# Altium schematic sheet FPGA_FMC.SchDoc
size A3
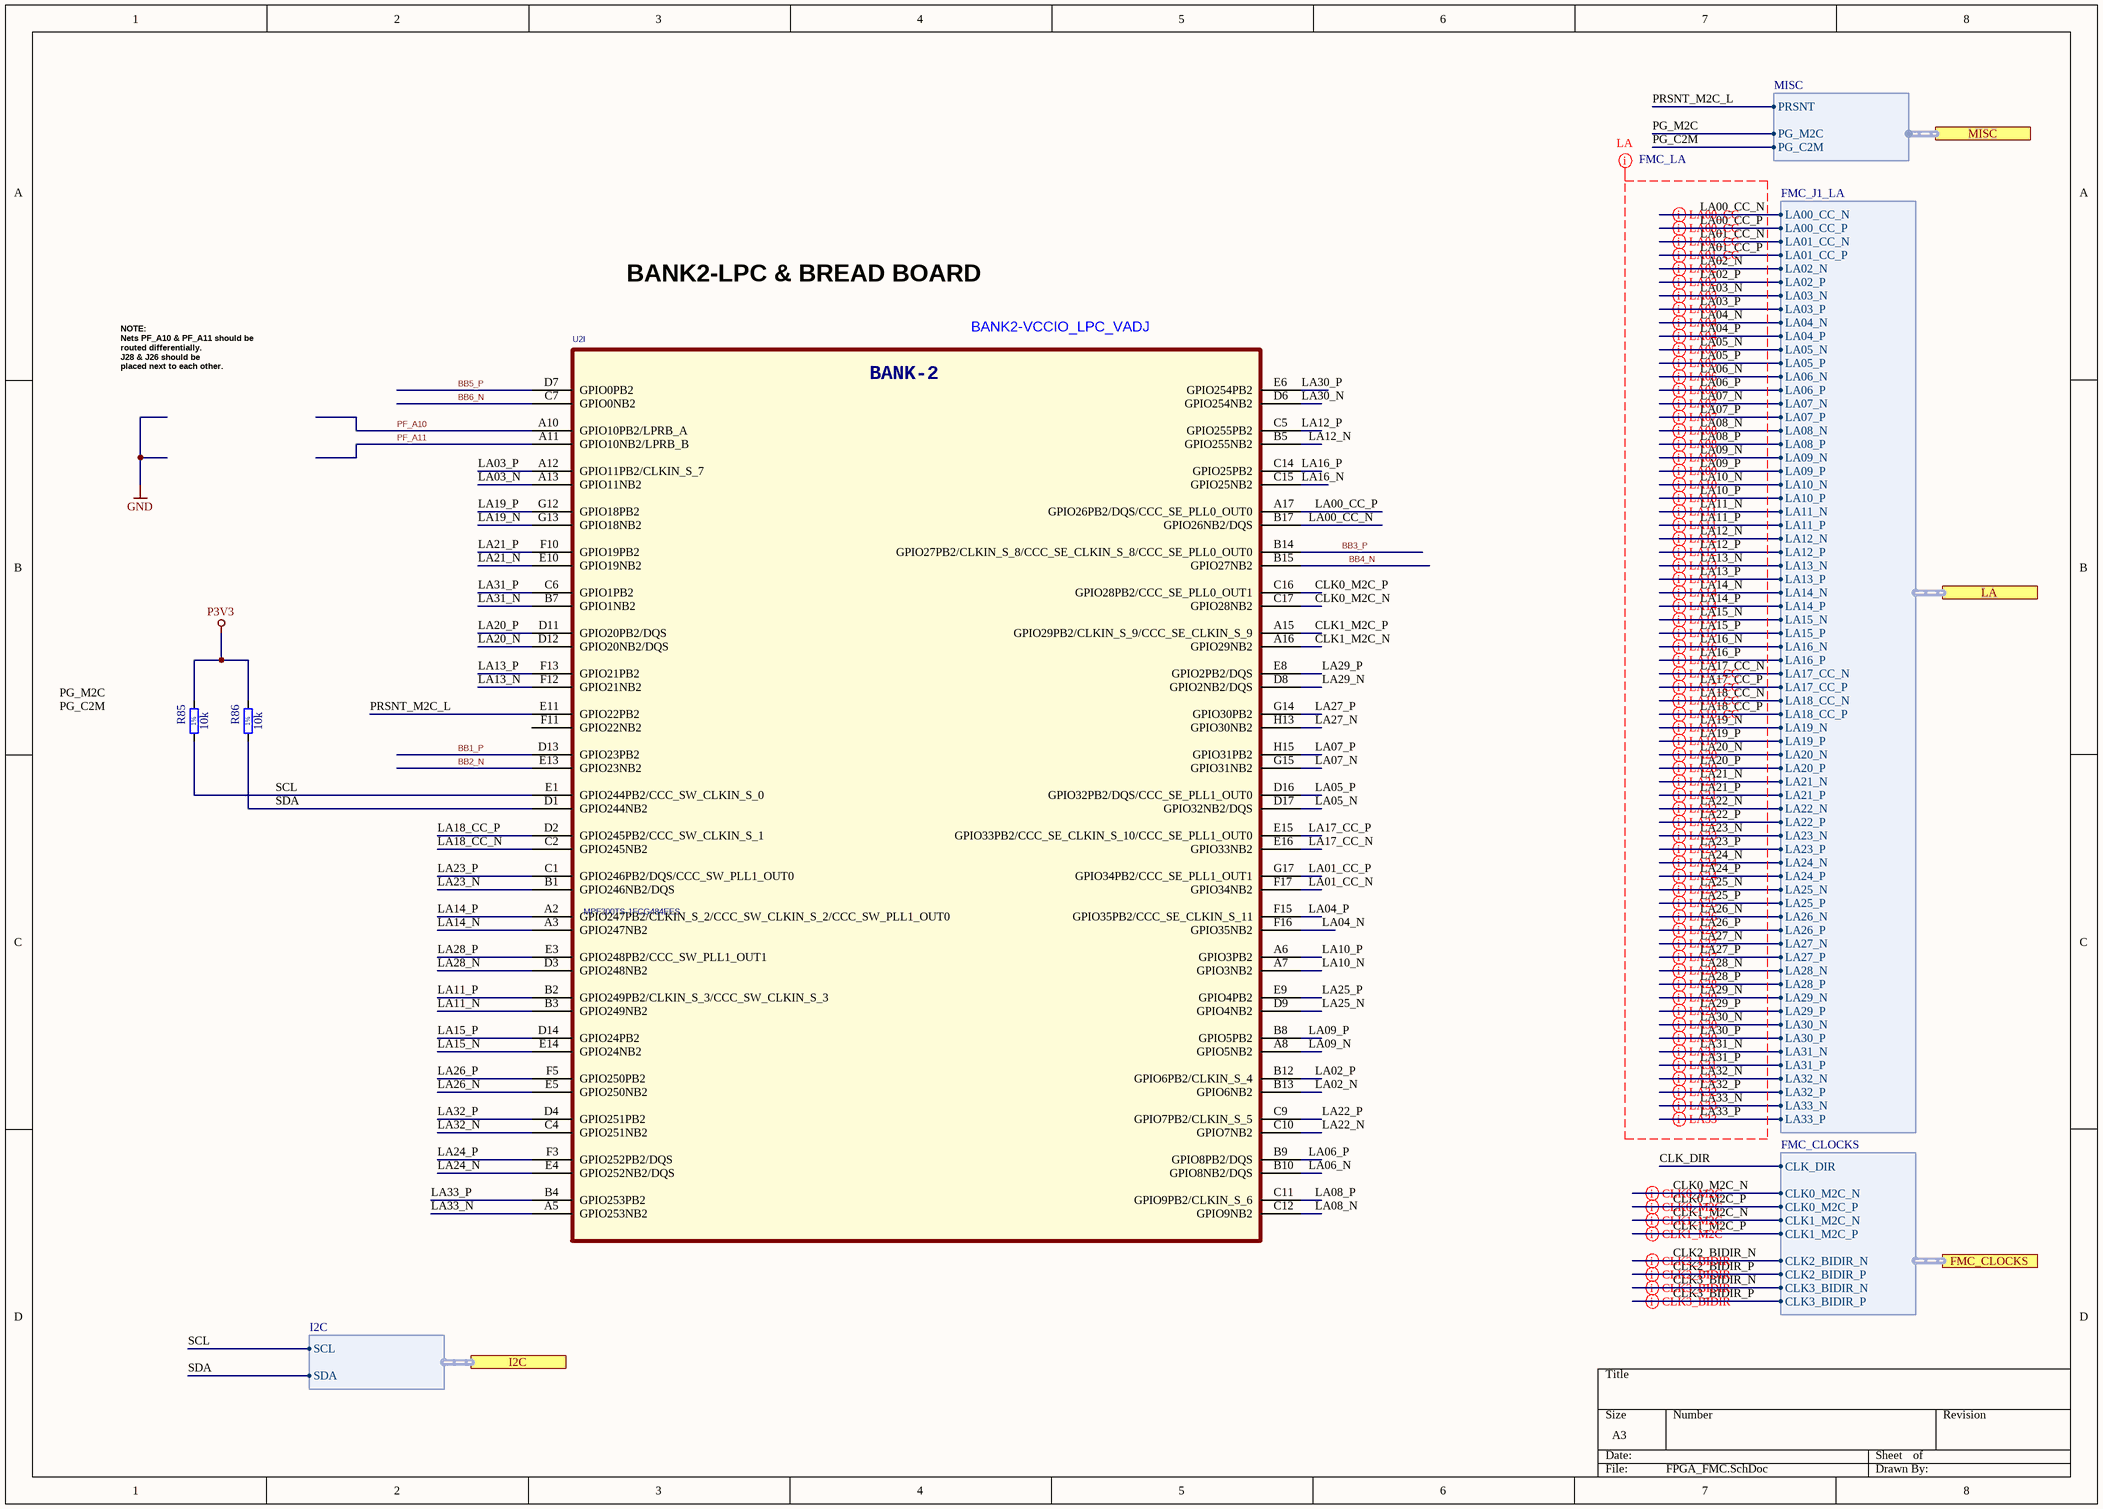
[diagram p0: FPGA_FMC.SchDoc]

## Parts
R85  10k  [RESC1005X40N]
R86  10k  [RESC1005X40N]
U2  MPF300TS-1FCG484EES  [BGA484C100P22X22_2300X2300X320]  (part I of 11)

## Ports
FMC_CLOCKS (harness FMC_CLOCKS), I2C (harness I2C), LA (harness FMC_J1_LA), MISC (harness MISC)

## Harnesses
FMC_J1_LA: LA05_N, LA05_P, LA06_N, LA06_P, LA09_N, LA09_P, LA10_N, LA10_P, LA13_N, LA13_P, LA14_N, LA14_P, LA23_N, LA23_P, LA26_N, LA26_P, LA27_N, LA27_P, LA02_N, LA02_P, LA03_N, LA03_P, LA04_N, LA04_P, LA07_N, LA07_P, LA08_N, LA08_P, LA11_N, LA11_P, LA12_N, LA12_P, LA15_N, LA15_P, LA16_N, LA16_P, LA19_N, LA19_P, LA20_N, LA20_P, LA21_N, LA21_P, LA22_N, LA22_P, LA24_N, LA24_P, LA25_N, LA25_P, LA28_N, LA28_P, LA29_N, LA29_P, LA30_N, LA30_P, LA31_N, LA31_P, LA32_N, LA32_P, LA33_N, LA33_P, LA00_CC_N, LA00_CC_P, LA01_CC_N, LA01_CC_P, LA17_CC_N, LA17_CC_P, LA18_CC_N, LA18_CC_P
FMC_CLOCKS: CLK2_BIDIR_N, CLK2_BIDIR_P, CLK3_BIDIR_N, CLK3_BIDIR_P, CLK0_M2C_N, CLK0_M2C_P, CLK1_M2C_N, CLK1_M2C_P, CLK_DIR
MISC: PRSNT, PG_M2C, PG_C2M
I2C: SCL, SDA

## Nets
P3V3: R85.2 R86.2
BB1_P: U2.D13(GPIO23PB2)
BB2_N: U2.E13(GPIO23NB2)
BB3_P: U2.B14(GPIO27PB2/CLKIN_S_8/CCC_SE_CLKIN_S_8/CCC_SE_PLL0_OUT0)
BB4_N: U2.B15(GPIO27NB2)
BB5_P: U2.D7(GPIO0PB2)
BB6_N: U2.C7(GPIO0NB2)
CLK0_M2C_N: U2.C17(GPIO28NB2) ; port FMC_CLOCKS.CLK0_M2C_N
CLK0_M2C_P: U2.C16(GPIO28PB2/CCC_SE_PLL0_OUT1) ; port FMC_CLOCKS.CLK0_M2C_P
CLK1_M2C_N: U2.A16(GPIO29NB2) ; port FMC_CLOCKS.CLK1_M2C_N
CLK1_M2C_P: U2.A15(GPIO29PB2/CLKIN_S_9/CCC_SE_CLKIN_S_9) ; port FMC_CLOCKS.CLK1_M2C_P
CLK2_BIDIR_N: port FMC_CLOCKS.CLK2_BIDIR_N
CLK2_BIDIR_P: port FMC_CLOCKS.CLK2_BIDIR_P
CLK3_BIDIR_N: port FMC_CLOCKS.CLK3_BIDIR_N
CLK3_BIDIR_P: port FMC_CLOCKS.CLK3_BIDIR_P
CLK_DIR: port FMC_CLOCKS.CLK_DIR
LA00_CC_N: U2.B17(GPIO26NB2/DQS) ; port LA.LA00_CC_N
LA00_CC_P: U2.A17(GPIO26PB2/DQS/CCC_SE_PLL0_OUT0) ; port LA.LA00_CC_P
LA01_CC_N: U2.F17(GPIO34NB2) ; port LA.LA01_CC_N
LA01_CC_P: U2.G17(GPIO34PB2/CCC_SE_PLL1_OUT1) ; port LA.LA01_CC_P
LA02_N: U2.B13(GPIO6NB2) ; port LA.LA02_N
LA02_P: U2.B12(GPIO6PB2/CLKIN_S_4) ; port LA.LA02_P
LA03_N: U2.A13(GPIO11NB2) ; port LA.LA03_N
LA03_P: U2.A12(GPIO11PB2/CLKIN_S_7) ; port LA.LA03_P
LA04_N: U2.F16(GPIO35NB2) ; port LA.LA04_N
LA04_P: U2.F15(GPIO35PB2/CCC_SE_CLKIN_S_11) ; port LA.LA04_P
LA05_N: U2.D17(GPIO32NB2/DQS) ; port LA.LA05_N
LA05_P: U2.D16(GPIO32PB2/DQS/CCC_SE_PLL1_OUT0) ; port LA.LA05_P
LA06_N: U2.B10(GPIO8NB2/DQS) ; port LA.LA06_N
LA06_P: U2.B9(GPIO8PB2/DQS) ; port LA.LA06_P
LA07_N: U2.G15(GPIO31NB2) ; port LA.LA07_N
LA07_P: U2.H15(GPIO31PB2) ; port LA.LA07_P
LA08_N: U2.C12(GPIO9NB2) ; port LA.LA08_N
LA08_P: U2.C11(GPIO9PB2/CLKIN_S_6) ; port LA.LA08_P
LA09_N: U2.A8(GPIO5NB2) ; port LA.LA09_N
LA09_P: U2.B8(GPIO5PB2) ; port LA.LA09_P
LA10_N: U2.A7(GPIO3NB2) ; port LA.LA10_N
LA10_P: U2.A6(GPIO3PB2) ; port LA.LA10_P
LA11_N: U2.B3(GPIO249NB2) ; port LA.LA11_N
LA11_P: U2.B2(GPIO249PB2/CLKIN_S_3/CCC_SW_CLKIN_S_3) ; port LA.LA11_P
LA12_N: U2.B5(GPIO255NB2) ; port LA.LA12_N
LA12_P: U2.C5(GPIO255PB2) ; port LA.LA12_P
LA13_N: U2.F12(GPIO21NB2) ; port LA.LA13_N
LA13_P: U2.F13(GPIO21PB2) ; port LA.LA13_P
LA14_N: U2.A3(GPIO247NB2) ; port LA.LA14_N
LA14_P: U2.A2(GPIO247PB2/CLKIN_S_2/CCC_SW_CLKIN_S_2/CCC_SW_PLL1_OUT0) ; port LA.LA14_P
LA15_N: U2.E14(GPIO24NB2) ; port LA.LA15_N
LA15_P: U2.D14(GPIO24PB2) ; port LA.LA15_P
LA16_N: U2.C15(GPIO25NB2) ; port LA.LA16_N
LA16_P: U2.C14(GPIO25PB2) ; port LA.LA16_P
LA17_CC_N: U2.E16(GPIO33NB2) ; port LA.LA17_CC_N
LA17_CC_P: U2.E15(GPIO33PB2/CCC_SE_CLKIN_S_10/CCC_SE_PLL1_OUT0) ; port LA.LA17_CC_P
LA18_CC_N: U2.C2(GPIO245NB2) ; port LA.LA18_CC_N
LA18_CC_P: U2.D2(GPIO245PB2/CCC_SW_CLKIN_S_1) ; port LA.LA18_CC_P
LA19_N: U2.G13(GPIO18NB2) ; port LA.LA19_N
LA19_P: U2.G12(GPIO18PB2) ; port LA.LA19_P
LA20_N: U2.D12(GPIO20NB2/DQS) ; port LA.LA20_N
LA20_P: U2.D11(GPIO20PB2/DQS) ; port LA.LA20_P
LA21_N: U2.E10(GPIO19NB2) ; port LA.LA21_N
LA21_P: U2.F10(GPIO19PB2) ; port LA.LA21_P
LA22_N: U2.C10(GPIO7NB2) ; port LA.LA22_N
LA22_P: U2.C9(GPIO7PB2/CLKIN_S_5) ; port LA.LA22_P
LA23_N: U2.B1(GPIO246NB2/DQS) ; port LA.LA23_N
LA23_P: U2.C1(GPIO246PB2/DQS/CCC_SW_PLL1_OUT0) ; port LA.LA23_P
LA24_N: U2.E4(GPIO252NB2/DQS) ; port LA.LA24_N
LA24_P: U2.F3(GPIO252PB2/DQS) ; port LA.LA24_P
LA25_N: U2.D9(GPIO4NB2) ; port LA.LA25_N
LA25_P: U2.E9(GPIO4PB2) ; port LA.LA25_P
LA26_N: U2.E5(GPIO250NB2) ; port LA.LA26_N
LA26_P: U2.F5(GPIO250PB2) ; port LA.LA26_P
LA27_N: U2.H13(GPIO30NB2) ; port LA.LA27_N
LA27_P: U2.G14(GPIO30PB2) ; port LA.LA27_P
LA28_N: U2.D3(GPIO248NB2) ; port LA.LA28_N
LA28_P: U2.E3(GPIO248PB2/CCC_SW_PLL1_OUT1) ; port LA.LA28_P
LA29_N: U2.D8(GPIO2NB2/DQS) ; port LA.LA29_N
LA29_P: U2.E8(GPIO2PB2/DQS) ; port LA.LA29_P
LA30_N: U2.D6(GPIO254NB2) ; port LA.LA30_N
LA30_P: U2.E6(GPIO254PB2) ; port LA.LA30_P
LA31_N: U2.B7(GPIO1NB2) ; port LA.LA31_N
LA31_P: U2.C6(GPIO1PB2) ; port LA.LA31_P
LA32_N: U2.C4(GPIO251NB2) ; port LA.LA32_N
LA32_P: U2.D4(GPIO251PB2) ; port LA.LA32_P
LA33_N: U2.A5(GPIO253NB2) ; port LA.LA33_N
LA33_P: U2.B4(GPIO253PB2) ; port LA.LA33_P
PF_A10: U2.A10(GPIO10PB2/LPRB_A)
PF_A11: U2.A11(GPIO10NB2/LPRB_B)
PG_C2M: port MISC.PG_C2M
PG_M2C: port MISC.PG_M2C
PRSNT_M2C_L: U2.E11(GPIO22PB2) ; port MISC.PRSNT
SCL: R85.1 U2.E1(GPIO244PB2/CCC_SW_CLKIN_S_0) ; port I2C.SCL
SDA: R86.1 U2.D1(GPIO244NB2) ; port I2C.SDA

Not connected (* = marked no-connect by the designer): U2 F11(GPIO22NB2)

## Layout directives
differential pair: CLK0_M2C_N, CLK0_M2C_P, CLK1_M2C_N, CLK1_M2C_P, CLK2_BIDIR_N, CLK2_BIDIR_P, CLK3_BIDIR_N, CLK3_BIDIR_P, LA00_CC_N, LA00_CC_P, LA01_CC_N, LA01_CC_P, LA02_N, LA02_P, LA03_N, LA03_P, LA04_N, LA04_P, LA05_N, LA05_P, LA06_N, LA06_P, LA07_N, LA07_P, LA08_N, LA08_P, LA09_N, LA09_P, LA10_N, LA10_P, LA11_N, LA11_P, LA12_N, LA12_P, LA13_N, LA13_P, LA14_N, LA14_P, LA15_N, LA15_P, LA16_N, LA16_P, LA17_CC_N, LA17_CC_P, LA18_CC_N, LA18_CC_P, LA19_N, LA19_P, LA20_N, LA20_P, LA21_N, LA21_P, LA22_N, LA22_P, LA23_N, LA23_P, LA24_N, LA24_P, LA25_N, LA25_P, LA26_N, LA26_P, LA27_N, LA27_P, LA28_N, LA28_P, LA29_N, LA29_P, LA30_N, LA30_P, LA31_N, LA31_P, LA32_N, LA32_P, LA33_N, LA33_P
net class FMC_LA: LA00_CC_N, LA00_CC_P, LA01_CC_N, LA01_CC_P, LA02_N, LA02_P, LA03_N, LA03_P, LA04_N, LA04_P, LA05_N, LA05_P, LA06_N, LA06_P, LA07_N, LA07_P, LA08_N, LA08_P, LA09_N, LA09_P, LA10_N, LA10_P, LA11_N, LA11_P, LA12_N, LA12_P, LA13_N, LA13_P, LA14_N, LA14_P, LA15_N, LA15_P, LA16_N, LA16_P, LA17_CC_N, LA17_CC_P, LA18_CC_N, LA18_CC_P, LA19_N, LA19_P, LA20_N, LA20_P, LA21_N, LA21_P, LA22_N, LA22_P, LA23_N, LA23_P, LA24_N, LA24_P, LA25_N, LA25_P, LA26_N, LA26_P, LA27_N, LA27_P, LA28_N, LA28_P, LA29_N, LA29_P, LA30_N, LA30_P, LA31_N, LA31_P, LA32_N, LA32_P, LA33_N, LA33_P

## Notes on the sheet
- BANK2-LPC & BREAD BOARD
- NOTE:
  Nets PF_A10 & PF_A11 should be
  routed differentially.
  J28 & J26 should be
  placed next to each other.
- BANK2-VCCIO_LPC_VADJ
- Labels drawn without touching a wire or pin: PG_C2M, PG_M2C
- (in symbol FPGA_MPF300T-FCG484, part I) BANK-2
- (in symbol R0402_10K_1%_0.0625W_100PPM) 1%

## Library data of the parts
R85 R86 = R0402_10K_1%_0.0625W_100PPM: Resistor - 1%; Manufacturer: GENERIC; Part Description: General Purpose Thick Film Chip Resistor; Manufacturer1 Part Number: 232270671003L; TC: ±100ppm/°C; PressFit: No; Manufacturer Part Number: R0402_10K_1%_0.0625W_100PPM; Part Number: R0402_10K_1%_0.0625W_100PPM; Tolerance: ±1%; Value: 10k; Component Kind: Standard; Component Type: Standard; Pin Count: 2; Status: Not Recommended; Power: 0.0625W; Case: 0402; Mounted: Yes; Sense: No; Socket: No; SMD: Yes; Manufacturer1 Example: YAGEO PHYCOMP; Manufacturer1 ComponentHeight: 0.4mm; HelpURL: \\cern.ch\dfs\Applications\Altium\Datasheets\R0402_Phycomp_RC0402.pdf; Author: CERN DEM JLC; CreateDate: 03/12/2007; LatestRevisionDate: 17/10/2012
U2 = FPGA_MPF300T-FCG484: FCG484,23mmX23mm,1.0mm pitch; Manufacturer: Microsemi; Part Number: MPF300TS-1FCG484I